# Altium schematic sheet LV Power.SchDoc
size A4; Organization: TESLA Motors, INC; Address1: 3500 Deer Creek Road; Address2: Palo Alto, CA; Address4: U.S.A.; SheetNumber: 6; SheetTotal: 13
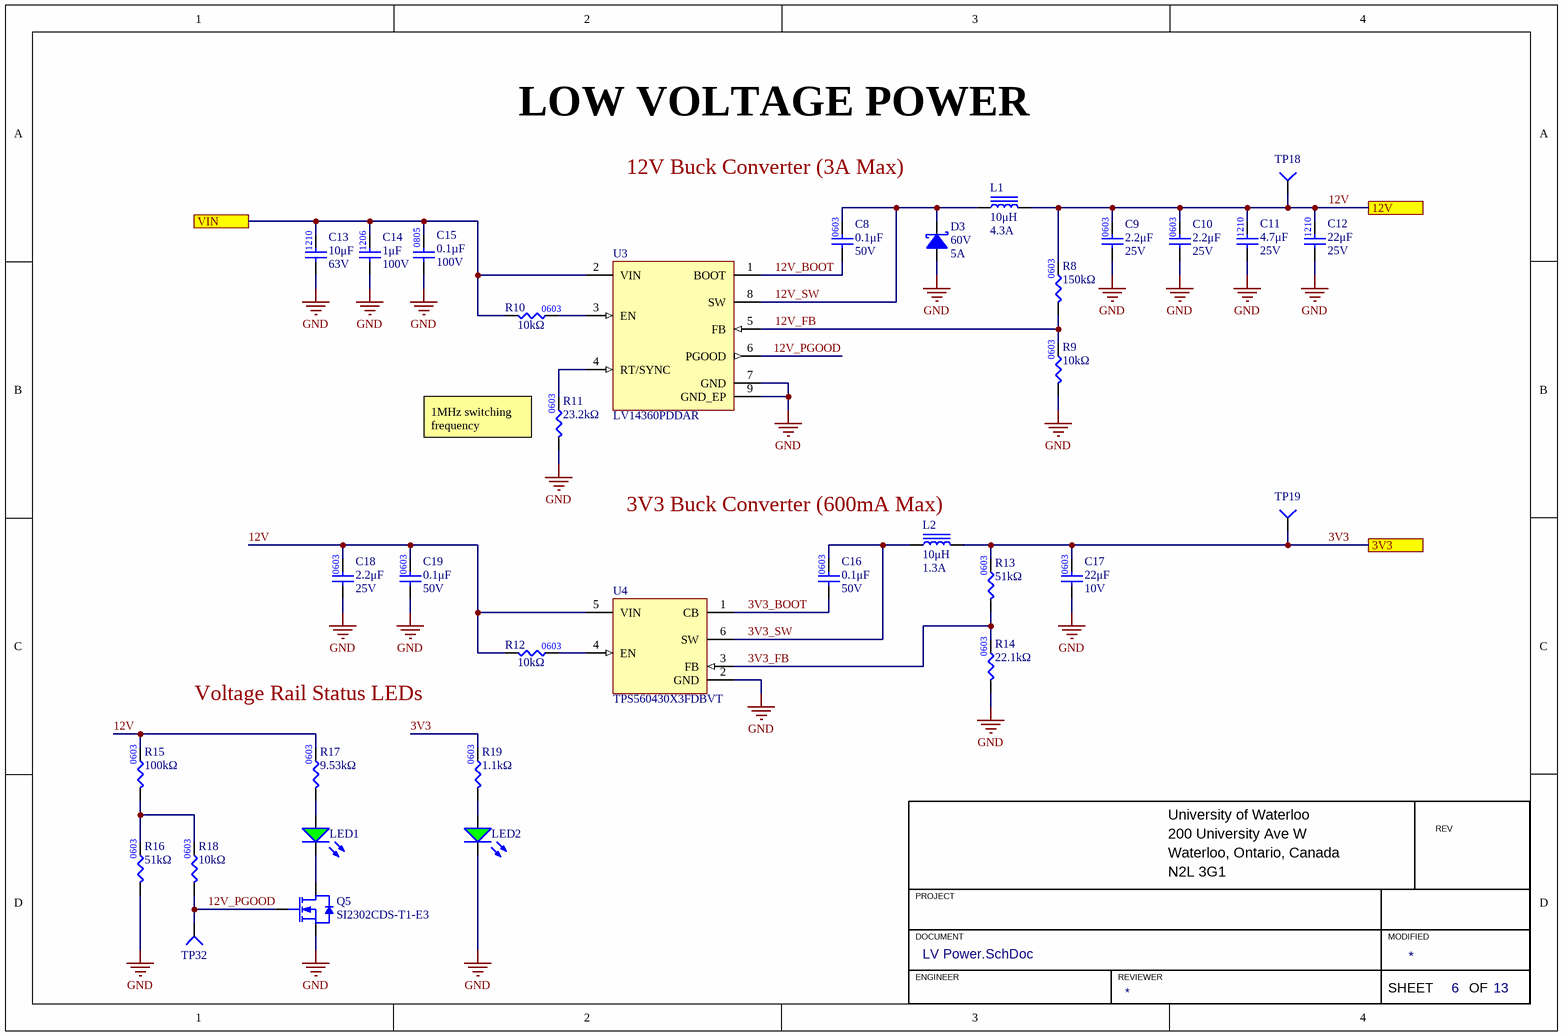
[diagram p0: LV Power.SchDoc]

## Parts
C8  value 0.1μF  Voltage Rating: 50V  [CAP0603]  (hidden comment: CAP_0.1uF_50V_0603)
C9  value 2.2μF  Voltage Rating: 25V  [CAP0603]  (hidden comment: CAP_2.2uF_25V_0603)
C10  value 2.2μF  Voltage Rating: 25V  [CAP0603]  (hidden comment: CAP_2.2uF_25V_0603)
C11  value 4.7μF  Voltage Rating: 25V  [CAP1210]  (hidden comment: CAP_4.7uF_25V_1210)
C12  value 22μF  Voltage Rating: 25V  [CAP1210]  (hidden comment: CAP_22uF_25V_1210)
C13  value 10μF  Voltage Rating: 63V  [CAP1210]  (hidden comment: CAP_10uF_63V_1210)
C14  value 1μF  Voltage Rating: 100V  [CAP1206]  (hidden comment: CAP_1uF_100V_1206)
C15  value 0.1µF  Voltage Rating: 100V  [CAP0805]  (hidden comment: CAP_0.1uF_100V_0805)
C16  value 0.1μF  Voltage Rating: 50V  [CAP0603]  (hidden comment: CAP_0.1uF_50V_0603)
C17  value 22μF  Voltage Rating: 10V  [CAP0603]  (hidden comment: CAP_22uF_10V_0603)
C18  value 2.2μF  Voltage Rating: 25V  [CAP0603]  (hidden comment: CAP_2.2uF_25V_0603)
C19  value 0.1μF  Voltage Rating: 50V  [CAP0603]  (hidden comment: CAP_0.1uF_50V_0603)
D3  Vr (Max): 60V  Current - Average Rectified (Io): 5A  [DIO-INC_SMA]  (hidden comment: DIO_SCHOTTKY_60V_5A)
L1  value 10μH  Current Rating: 4.3A  [IND_MURATA_DS106C2]  (hidden comment: IND_10uH_4.3A)
L2  value 10μH  Current Rating: 1.3A  [IND_ABRACON_ASPI4030S]  (hidden comment: IND_10uH_1.3A)
LED1  LED_GREEN_0805  [LED_0805_GREEN]  (value not drawn)
LED2  LED_GREEN_0805  [LED_0805_GREEN]  (value not drawn)
Q5  Manufacturer Part Number 1: SI2302CDS-T1-E3  [SOT23-3]  (hidden comment: NMOS_20V_6A)
R8  value 150kΩ  [RES0603]  (hidden comment: RES_150kΩ_0603_1%)
R9  value 10kΩ  [RES0603]  (hidden comment: RES_10kΩ_0603_1%)
R10  value 10kΩ  [RES0603]  (hidden comment: RES_10kΩ_0603_1%)
R11  value 23.2kΩ  [RES0603]  (hidden comment: RES_23.2kΩ_0603_1%)
R12  value 10kΩ  [RES0603]  (hidden comment: RES_10kΩ_0603_1%)
R13  value 51kΩ  [RES0603]  (hidden comment: RES_51kΩ_0603_1%)
R14  value 22.1kΩ  [RES0603]  (hidden comment: RES_22.1kΩ_0603_1%)
R15  value 100kΩ  [RES0603]  (hidden comment: RES_100kΩ_0603_1%)
R16  value 51kΩ  [RES0603]  (hidden comment: RES_51kΩ_0603_1%)
R17  value 9.53kΩ  [RES0603]  (hidden comment: RES_9.53kΩ_0603_1%)
R18  value 10kΩ  [RES0603]  (hidden comment: RES_10kΩ_0603_1%)
R19  value 1.1kΩ  [RES0603]  (hidden comment: RES_1.1kΩ_0603_1%)
TP18  TESTPOINT_KEYSTONE_LOOP  [KEYSTONE_5019]  (value not drawn)
TP19  TESTPOINT_KEYSTONE_LOOP  [KEYSTONE_5019]  (value not drawn)
TP32  TESTPOINT_1MM_CIRCLE  [TESTPOINT_CIRCLE_1MM]  (value not drawn)  (no BOM)
U3  LV14360PDDAR  [TI_8-PowerPad-SOIC]
U4  TPS560430X3FDBVT  [SOT23-6]

## Ports
3V3, 12V, VIN

## Nets
GND: C9.1 C10.1 C11.1 C12.1 C13.1 C14.1 C15.1 C17.1 C18.1 C19.1 D3.2(Anode) LED2.2(K) Q5.2(SOURCE) R9.1 R11.1 R14.1 R16.1 U3.7(GND) U3.9(GND_EP) U4.2(GND)
3V3: C17.2 L2.2 R13.2 R19.2 TP19.1(=value) ; port 3V3
3V3_BOOT: C16.1 U4.1(CB)
3V3_FB: R13.1 R14.2 U4.3(FB)
3V3_SW: C16.2 L2.1 U4.6(SW)
12V: C9.2 C10.2 C11.2 C12.2 C18.2 C19.2 L1.2 R8.2 R12.1 R15.2 R17.2 TP18.1(=value) U4.5(VIN) ; port 12V
12V_BOOT: C8.1 U3.1(BOOT)
12V_FB: R8.1 R9.2 U3.5(FB)
12V_PGOOD: Q5.1(GATE) R18.1 TP32.1(=value) U3.6(PGOOD)
12V_SW: C8.2 D3.1(Cathode) L1.1 U3.8(SW)
VIN: C13.2 C14.2 C15.2 R10.1 U3.2(VIN) ; port VIN
NetLED1_1: LED1.1(A) R17.1
NetLED1_2: LED1.2(K) Q5.3(DRAIN)
NetLED2_1: LED2.1(A) R19.1
NetR10_2: R10.2 U3.3(EN)
NetR11_2: R11.2 U3.4(RT/SYNC)
NetR12_2: R12.2 U4.4(EN)
NetR15_1: R15.1 R16.2 R18.2

## Notes on the sheet
- LOW VOLTAGE POWER
- 12V Buck Converter (3A Max)
- (near R11) 1MHz switching frequency
- (near L2) 3V3 Buck Converter (600mA Max)
- Voltage Rail Status LEDs
- University of Waterloo
- 200 University Ave W
- REV
- PROJECT
- Waterloo, Ontario, Canada
- N2L 3G1
- DOCUMENT
- ENGINEER
- REVIEWER
- MODIFIED
- SHEET
- OF
- (in symbol CAP_2.2uF_25V_0603) 0603
- (in symbol CAP_4.7uF_25V_1210) 1210
- (in symbol RES_22.1kΩ_0603_1%) 0603
- (in symbol RES_51kΩ_0603_1%) 0603
- (in symbol RES_100kΩ_0603_1%) 0603
- (in symbol RES_150kΩ_0603_1%) 0603

## Library data of the parts
C8 C16 C19 = CAP_0.1uF_50V_0603: CAP CER 0.1UF 50V X7R 0603; Manufacturer Part Number 1: CC0603KRX7R9BB104; Manufacturer 1: Yageo; Package/Footprint: 0603; Supplier Part Number 1: 311-1344-1-ND; Supplier 1: Digi-Key; Mounting Type: SMD; Dielectric: X7R
C9 C10 C18 = CAP_2.2uF_25V_0603: CAP CER 2.2UF 25V X5R 0603; Manufacturer Part Number 1: C1608X5R1E225K080AB; Manufacturer 1: TDK Corporation; Dielectric: 5; Supplier Part Number 1: 445-5964-1-ND; Supplier 1: Digi-Key
C11 = CAP_4.7uF_25V_1210: CAP CER 4.7UF 25V X8L 1210; Manufacturer 1: Murata Electronics; Manufacturer Part Number 1: GCJ32EL81E475KA01L; Supplier 1: Digi-Key; Supplier Part Number 1: 490-16465-1-ND; Dielectric: X8L
C12 = CAP_22uF_25V_1210: CAP CER 22UF 25V X7R 1210; Manufacturer 1: Murata Electronics; Manufacturer Part Number 1: GRM32ER71E226ME15K; Package/Footprint: 1210; Supplier 1: Digi-Key; Supplier Part Number 1: 490-14682-1-ND; Mounting Type: SMD
C13 = CAP_10uF_63V_1210: CAP CER 10UF 63V X7R 1210; Manufacturer 1: Samsung Electro-Mechanics; Manufacturer Part Number 1: CL32B106KMVNNWE; Mounting Type: SMD; Package: 1210; Dielectric: X7R; Supplier 1: Digikey; Supplier Part Number 1: 1276-7053-6-ND
C14 = CAP_1uF_100V_1206: CAP CER 1UF 100V X7R 1206; Supplier 1: Digi-Key; Mounting Type: SMD; Package: 1206; Supplier Part Number 1: 490-16468-1-ND
C15 = CAP_0.1uF_100V_0805: CAP CER 0.1UF 100V X7R 0805; Manufacturer 1: TDK Corporation; Manufacturer Part Number 1: C2012X7R2A104K125AA; Package: 0805; Supplier 1: Digi-Key; Supplier Part Number 1: 445-1418-1-ND
C17 = CAP_22uF_10V_0603: CAP CER 22UF 10V X5R 0603; Manufacturer: Taiyo Yuden; Manufacturer Part Number: LMK107BBJ226MA-T; Supplier 1: Digi-Key; Supplier Part Number 1: 587-4913-1-ND; Package: 0603
D3 = DIO_SCHOTTKY_60V_5A: DIODE SCHOTTKY 60V 5A SMA; Manufacturer 1: Diodes Incorporated; Manufacturer Part Number 1: SDT5A60SA-13; Forward Voltage: 520mV @5A; Mounting Type: SMD; Package/Footprint: SMA; Supplier 1: Digi-Key; Supplier Part Number 1: B260S1F-7DICT-ND
L1 = IND_10uH_4.3A: FIXED IND 10UH 4.3A 28 MOHM SMD; Manufacturer 1: Murata Electronics; Manufacturer Part Number 1: #B966AS-100M=P3; Supplier Part Number 1: 490-14123-1-ND; Supplier 1: Digi-Key; Mounting Type: SMD; Package/Footprint: SMD
L2 = IND_10uH_1.3A: FIXED IND 12UH 1.3A 135 MOHM SMD; Manufacturer 1: Abracon LLC; Manufacturer Part Number 1: ASPI-4030S-120M-T; Supplier Part Number 1: 535-ASPI-4030S-120M-TCT-ND; Supplier 1: Digi-Key; Mounting Type: SMD; Package/Footprint: SMD
LED1 LED2 = LED_GREEN_0805: LED GREEN DIFFUSED 0805 SMD; Manufacturer 1: OSRAM; Manufacturer Part Number 1: LG R971-KN-1; Forward Voltage Drop: 2.2V; Package/Footprint: 0805; Supplier Part Number 1: 475-1410-1-ND; Supplier 1: Digi-Key; Mounting Type: SMD
Q5 = NMOS_20V_2.6A: MOSFET N-CH 20V 2.6A SOT23-3; Manufacturer 1: Vishay Siliconix; Package/Footprint: SOT-23-3; Supplier 1: Digi-Key; Supplier Part Number 1: SI2302CDS-T1-E3CT-ND
R8 = RES_150kΩ_0603_1%: RES 150K OHM 1% 1/10W 0603; Manufacturer 1: Yageo; Manufacturer Part Number 1: RC0603FR-07150KL; Supplier Part Number 1: 311-150KHRCT-ND; Supplier 1: Digi-Key; Mounting Type: Surface Mount
R9 R10 R12 R18 = RES_10kΩ_0603_1%: RES 10K OHM 1% 1/8W 0603; Manufacturer 1: Stackpole Electronics Inc; Manufacturer Part Number 1: RNCP0603FTD10K0; Supplier Part Number 1: RNCP0603FTD10K0CT-ND; Supplier 1: Digi-Key; Mounting Type: SMD; Package: 0603
R11 = RES_23.2kΩ_0603_1%: RES 23.2K OHM 1% 1/10W 0603; Manufacturer Part Number 1: RMCF0603FT23K2; Manufacturer 1: Stackpole Electronics Inc; Package/Footprint: 0603; Supplier 1: Digi-Key; Supplier Part Number 1: RMCF0603FT23K2CT-ND
R13 R16 = RES_51kΩ_0603_1%: RES 51K OHM 1% 1/10W 0603; Manufacturer Part Number 1: RC0603FR-0751KL; Manufacturer 1: Yageo; Supplier 1: Digi-Key; Supplier Part Number 1: 311-51.0KHRCT-ND
R14 = RES_22.1kΩ_0603_1%: RES 22.1K OHM 1% 1/10W 0603; Manufacturer 1: Stackpole Electronics Inc; Manufacturer Part Number 1: RMCF0603FT22K1; Supplier Part Number 1: RMCF0603FT22K1CT-ND; Supplier 1: Digi-Key
R15 = RES_100kΩ_0603_1%: RES 100K OHM 1% 1/10W 0603; Manufacturer Part Number 1: RC0603FR-07100KL; Manufacturer 1: Yageo; Supplier 1: Digi-Key; Supplier Part Number 1: 311-100KHRCT-ND
R17 = RES_9.53kΩ_0603_1%: RES 9.53K OHM 1% 1/10W 0603; Manufacturer 1: Stackpole Electronics Inc; Manufacturer Part Number 1: RC0603FR-079K53L; Supplier Part Number 1: 311-9.53KHRCT-ND; Supplier 1: Digi-Key; Mounting Type: SMD; Package: 0603
R19 = RES_1.1kΩ_0603_1%: RES 1.1K OHM 1% 1/10W 0603; Manufacturer 1: Yageo; Manufacturer Part Number 1: RC0603FR-071K1L; Supplier Part Number 1: 311-1.10KHRCT-ND; Supplier 1: Digi-Key; Mounting Type: SMD; Package: 0603
TP18 TP19 = TESTPOINT_KEYSTONE_LOOP: PC TEST POINT MINIATURE; Manufacturer 1: Keystone Electronics; Manufacturer Part Number 1: 5019; Package/Footprint: SMD; Supplier 1: Digi-Key; Mounting Type: SMD; Supplier Part Number 1: 36-5019CT-ND
TP32 = TESTPOINT_1MM_CIRCLE: TESTPOINT 1MM CIRCLE
U3 = LV14360PDDAR: IC REG BUCK ADJ 3A 8SOPWR; Manufacturer 1: Texas Instruments; Package/Footprint: 8-PowerSOIC; Manufacturer Part Number 1: LV14360PDDAR; Supplier 1: Digikey; Supplier Part Number 1: 296-LV14360PDDARCT-ND
U4 = TPS560430X3FDBVT: IC REG BUCK 3.3V 600MA SOT23-6; Manufacturer 1: Texas Instruments; Package/Footprint: SOT-23-6; Manufacturer Part Number 1: TPS560430X3FDBVT; Supplier 1: Digikey; Supplier Part Number 1: 296-53224-1-ND